# EAGLE schematic stepper_motor (EAGLE 5.11)
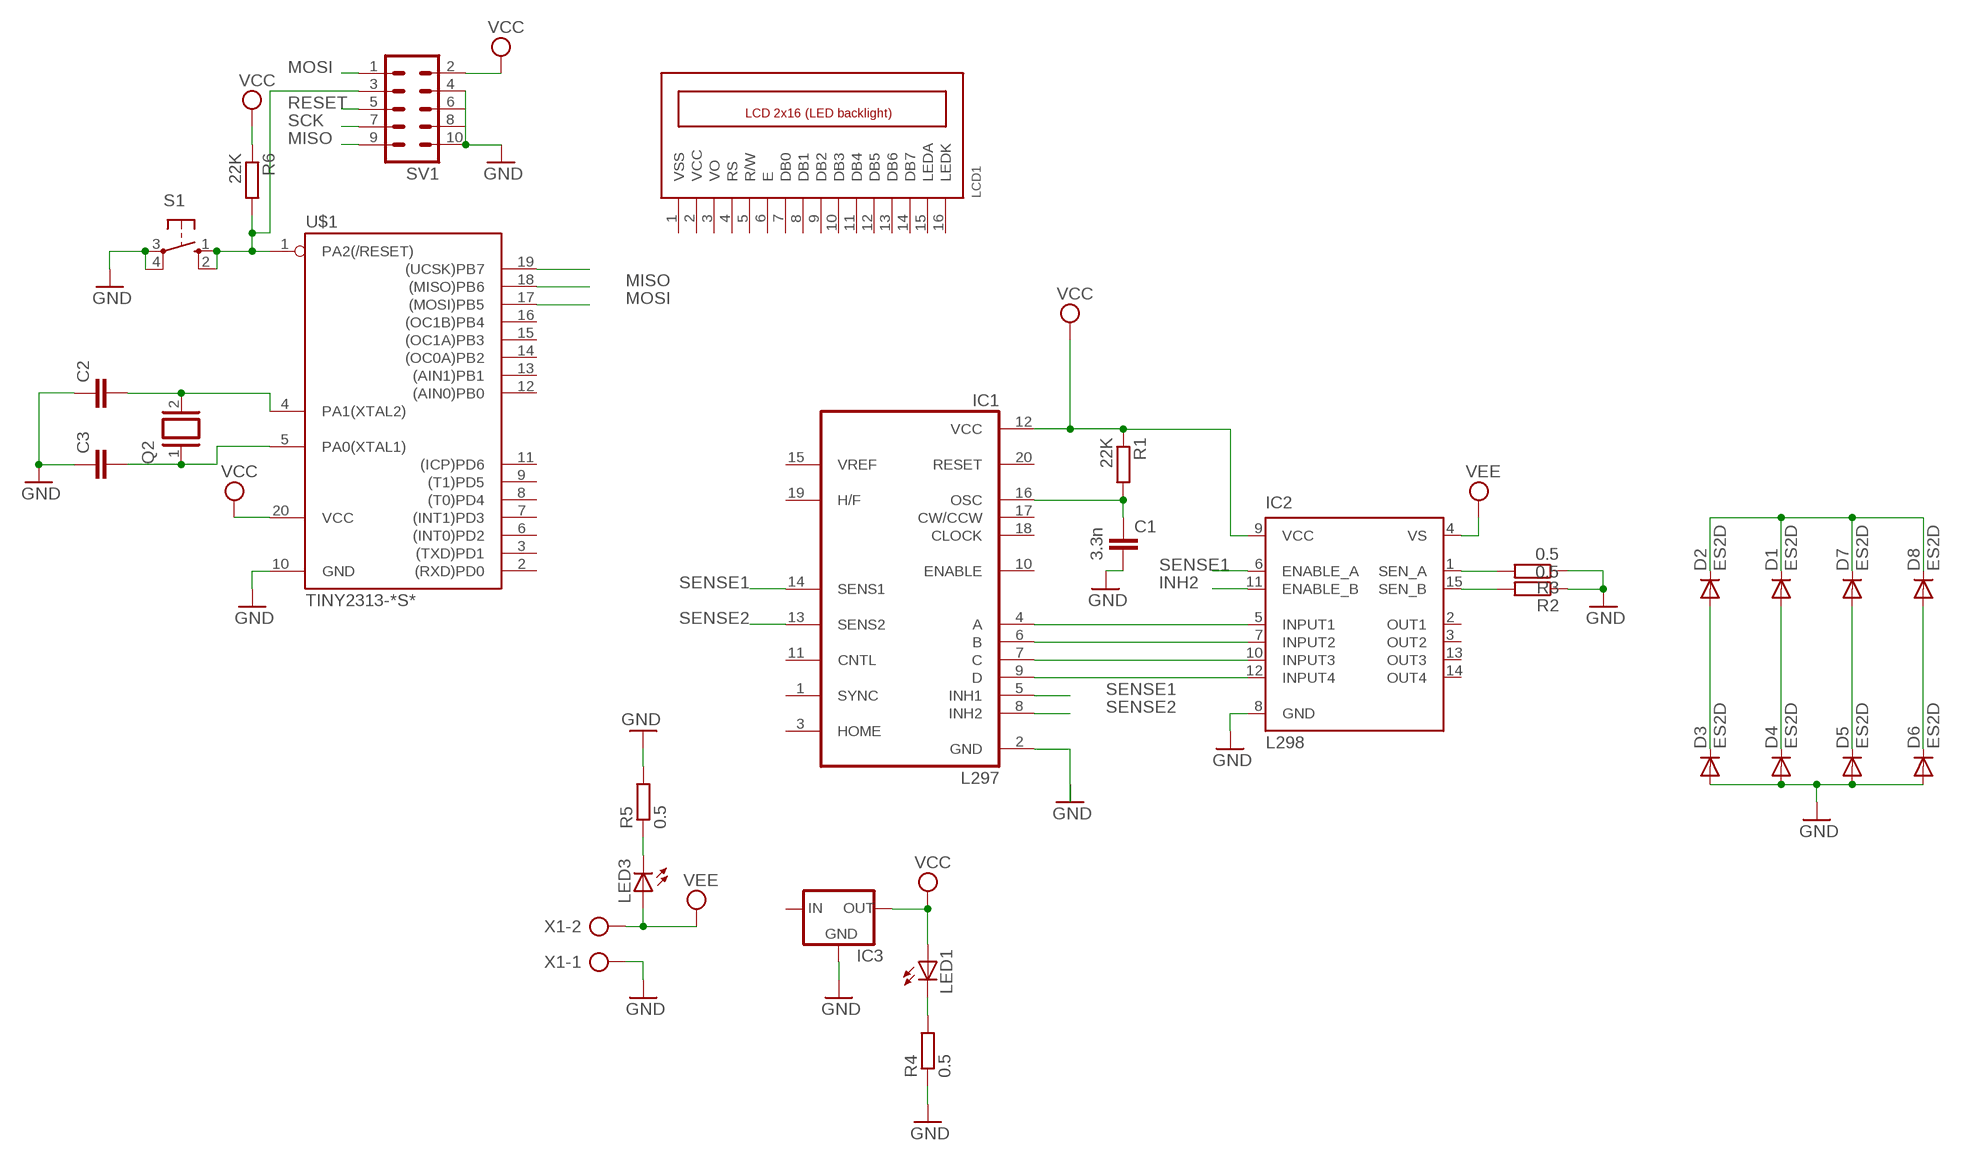
[diagram p0: schematic, sheet 1]

## Parts
C1  3.3n  C-EU025-024X044  [C025-024X044]
C2  C-EU025-024X044  [C025-024X044]
C3  C-EU025-024X044  [C025-024X044]
D1  ES2D  [SMB]
D2  ES2D  [SMB]
D3  ES2D  [SMB]
D4  ES2D  [SMB]
D5  ES2D  [SMB]
D6  ES2D  [SMB]
D7  ES2D  [SMB]
D8  ES2D  [SMB]
IC1  L297  [DIL20]
IC2  L298  [MULTIWATT-15]
IC3  78LXX  [78LXX]
LCD1  LCD_2X16_SIL  [HY-1602F]
LED1  LEDCHIP-LED0805  [CHIP-LED0805]
LED3  LEDCHIP-LED0805  [CHIP-LED0805]
Q2  XTAL  [Q]
R1  22K  R-EU_0204/2V  [0204V]
R2  0.5  R-EU_0204/2V  [0204V]
R3  0.5  R-EU_0204/2V  [0204V]
R4  0.5  R-EU_0204/2V  [0204V]
R5  0.5  R-EU_0204/2V  [0204V]
R6  22K  R-EU_0204/2V  [0204V]
S1  10-XX  [B3F-10XX]
SV1  MA05-2  [MA05-2]
U$1  TINY2313-*S*  [SO20L$]
X1  AK300/2  [AK300/2]

## Nets
GND: C1.2 C2.1 C3.1 D3.A D4.A D5.A D6.A IC1.2(GND) IC2.8(GND) IC3.GND R2.1 R3.1 R4.1 R5.2 S1.3(P) S1.4(P1) SV1.4 SV1.10 U$1.10(GND) X1.1
INH2: IC2.11(ENABLE_B)
MISO: SV1.9 U$1.18((MISO)PB6)
MOSI: R6.2 S1.1(S) S1.2(S1) SV1.1 SV1.3 U$1.1(PA2(/RESET)) U$1.17((MOSI)PB5)
N$1: IC1.4(A) IC2.5(INPUT1)
N$2: IC1.6(B) IC2.7(INPUT2)
N$3: IC1.7(C) IC2.10(INPUT3)
N$4: IC1.9(D) IC2.12(INPUT4)
N$5: IC2.1(SEN_A) R3.2
N$6: IC2.15(SEN_B) R2.2
N$7: C1.1 IC1.16(OSC) R1.2
N$8: D6.C D8.A
N$9: D1.C D2.C D7.C D8.C
N$10: D2.A D3.C
N$11: D1.A D4.C
N$12: D5.C D7.A
N$14: U$1.19((UCSK)PB7)
N$15: LED1.C R4.2
N$17: LED3.C R5.1
N$18: C2.2 Q2.2 U$1.4(PA1(XTAL2))
N$19: C3.2 Q2.1 U$1.5(PA0(XTAL1))
RESET: SV1.5
SCK: SV1.7
SENSE1: IC1.5(INH1) IC1.14(SENS1) IC2.6(ENABLE_A)
SENSE2: IC1.8(INH2) IC1.13(SENS2)
VCC: IC1.12(VCC) IC2.9(VCC) IC3.OUT LED1.A R1.1 R6.1 SV1.2 U$1.20(VCC)
VEE: IC2.4(VS) LED3.A X1.2
Unconnected: IC1.1(SYNC) IC1.3(HOME) IC1.10(ENABLE) IC1.11(CNTL) IC1.15(VREF) IC1.17(CW/CCW) IC1.18(CLOCK) IC1.19(H/F) IC1.20(RESET) IC2.2(OUT1) IC2.3(OUT2) IC2.13(OUT3) IC2.14(OUT4) IC3.IN LCD1.3(VO) LCD1.4(RS) LCD1.5(R/W) LCD1.6(E) LCD1.7(DB0) LCD1.8(DB1) LCD1.9(DB2) LCD1.10(DB3) LCD1.11(DB4) LCD1.12(DB5) LCD1.13(DB6) LCD1.14(DB7) LCD1.15(LEDA) LCD1.16(LEDK) SV1.6 SV1.8 U$1.2((RXD)PD0) U$1.3((TXD)PD1) U$1.6((INT0)PD2) U$1.7((INT1)PD3) U$1.8((T0)PD4) U$1.9((T1)PD5) U$1.11((ICP)PD6) U$1.12((AIN0)PB0) U$1.13((AIN1)PB1) U$1.14((OC0A)PB2) U$1.15((OC1A)PB3) U$1.16((OC1B)PB4)

## Power pins joined to a net without a drawn wire
VCC: LCD1.2(VCC)
VSS: LCD1.1(VSS)

## Library data of the parts
C1-C3 = resistor:C-EU: CAPACITOR, European symbol
D1-D8 = diode:ES2D: DIODE super fast rectifier, 2 A
IC1 = st-microelectronics:L297: STEPPER MOTOR CONTROLLER; MPN: L297/1; OC_FARNELL: 1094209; OC_NEWARK: 56P8258
IC2 = st-microelectronics:L298: DUAL FULL-BRIDGE DRIVER; MPN: L298N; OC_FARNELL: 1589425; OC_NEWARK: 32M1527
IC3 = v-reg:78LXX: VOLTAGE REGULATOR
LCD1 = lcd_2x16_led_backlight:LCD_2X16_SIL
LED1 LED3 = led:LED: LED OSRAM: - CHIPLED LG R971, LG N971, LY N971, LG Q971, LY Q971, LO R971, LY R971 LH N974, LH R974 LS Q976, LO Q976, LY Q976 LO Q996 - Hyper CHIPLED LW Q18S LB Q993, LB Q99A, LB R99A - SideLED LS A670, LO A670, LY A670, LG A670, LP A670 LB A673, LV A673, LT A673, LW A673 LH A674 LY A675 LS A676, LA A676, LO A676, LY A676, LW A676 LS A679, LY A679, LG A679 - Hyper Micro SIDELED® LS Y876, LA Y876, LO Y876, LY Y876 LT Y87S - SmartLED LW L88C, LW L88S LB L89C, LB L89S, LG L890 LS L89K, LO L89K, LY L89K LS L896, LA L896, LO L896, LY L896 - TOPLED LS T670, LO T670, LY T670, LG T670, LP T670 LSG T670, LSP T670, LSY T670, LOP T670, LYG T670 LG T671, LOG T671, LSG T671 LB T673, LV T673, LT T673, LW T673 LH T674 LS T676, LA T676, LO T676, LY T676, LB T676, LH T676, LSB T676, LW T676 LB T67C, LV T67C, LT T67C, LS T67K, LO T67K, LY T67K, LW E67C LS E67B, LA E67B, LO E67B, LY E67B, LB E67C, LV E67C, LT E67C LW T67C LS T679, LY T679, LG T679 LS T770, LO T770, LY T770, LG T770, LP T770 LB T773, LV T773, LT T773, LW T773 LH T774 LS E675, LA E675, LY E675, LS T675 LS T776, LA T776, LO T776, LY T776, LB T776 LHGB T686 LT T68C, LB T68C - Hyper Mini TOPLED® LB M676 - Mini TOPLED Santana® LG M470 LS M47K, LO M47K, LY M47K Source: http://www.osram.convergy.de LUXEON: - LUMILED® LXK2-PW12-R00, LXK2-PW12-S00, LXK2-PW14-U00, LXK2-PW14-V00 LXK2-PM12-R00, LXK2-PM12-S00, LXK2-PM14-U00 LXK2-PE12-Q00, LXK2-PE12-R00, LXK2-PE12-S00, LXK2-PE14-T00, LXK2-PE14-U00 LXK2-PB12-K00, LXK2-PB12-L00, LXK2-PB12-M00, LXK2-PB14-N00, LXK2-PB14-P00, LXK2-PB14-Q00 LXK2-PR12-L00, LXK2-PR12-M00, LXK2-PR14-Q00, LXK2-PR14-R00 LXK2-PD12-Q00, LXK2-PD12-R00, LXK2-PD12-S00 LXK2-PH12-R00, LXK2-PH12-S00 LXK2-PL12-P00, LXK2-PL12-Q00, LXK2-PL12-R00 Source: www.luxeon.com KINGBRIGHT: KA-3528ASYC Source: www.kingbright.com
Q2 = special:XTAL: CRYSTAL
R1-R6 = resistor:R-EU_: RESISTOR, European symbol
S1 = switch-omron:10-XX: OMRON SWITCH; MPN: B3F-1000; OC_FARNELL: 176432; OC_NEWARK: 36M3542
SV1 = con-lstb:MA05-2: PIN HEADER; OC_FARNELL: unknown; OC_NEWARK: unknown
U$1 = avr-6:TINY2313*: Atmel Tiny2313 2K Flash, 128 bytes EEPROM, 128 bytes RAM
X1 = con-ptr500:AK300/2: CONNECTOR; OC_FARNELL: unknown; OC_NEWARK: unknown